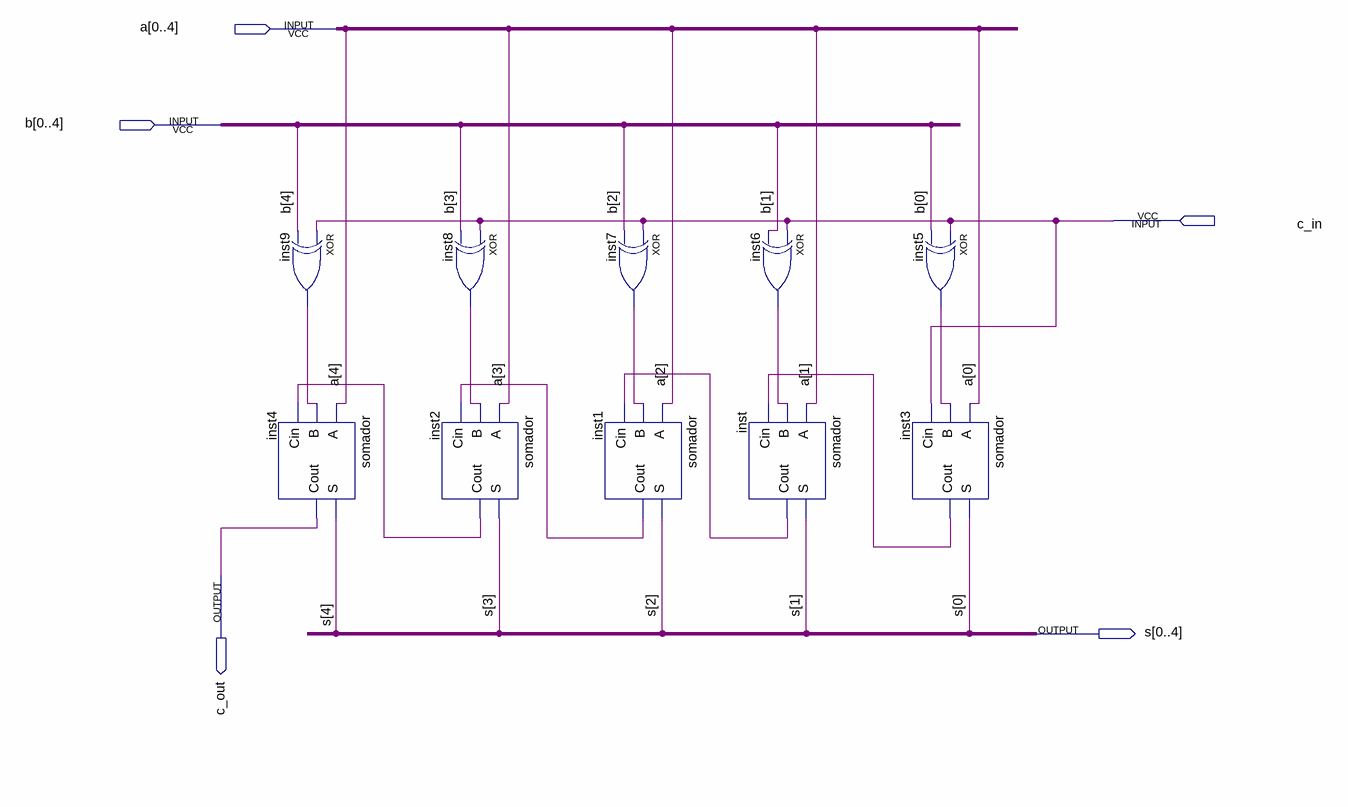
[diagram p0: schematic sheet]
// Quartus schematic adder.bdf as structural Verilog: 10 symbols, 5 pins
module adder (
  input  [0:4] a,
  input  [0:4] b,
  input  c_in,
  output c_out,
  output [0:4] s
);

  wire inst1_cout, inst2_cout, inst3_cout, inst5_out, inst6_out, inst7_out, inst8_out, inst9_out, inst_cout;

  xor inst9 (inst9_out, c_in, b[4]);
  somador inst4 (.A(a[4]), .B(inst9_out), .Cin(inst2_cout), .S(s[4]), .Cout(c_out));
  xor inst8 (inst8_out, c_in, b[3]);
  somador inst2 (.A(a[3]), .B(inst8_out), .Cin(inst1_cout), .S(s[3]), .Cout(inst2_cout));
  somador inst1 (.A(a[2]), .B(inst7_out), .Cin(inst_cout), .S(s[2]), .Cout(inst1_cout));
  xor inst7 (inst7_out, c_in, b[2]);
  xor inst6 (inst6_out, c_in, b[1]);
  somador inst (.A(a[1]), .B(inst6_out), .Cin(inst3_cout), .S(s[1]), .Cout(inst_cout));
  somador inst3 (.A(a[0]), .B(inst5_out), .Cin(c_in), .S(s[0]), .Cout(inst3_cout));
  xor inst5 (inst5_out, c_in, b[0]);
endmodule
